# EasyEDA Pro project ProDoc_D133手机主板V0.2_2024-07-06.epro, board PCB1_1
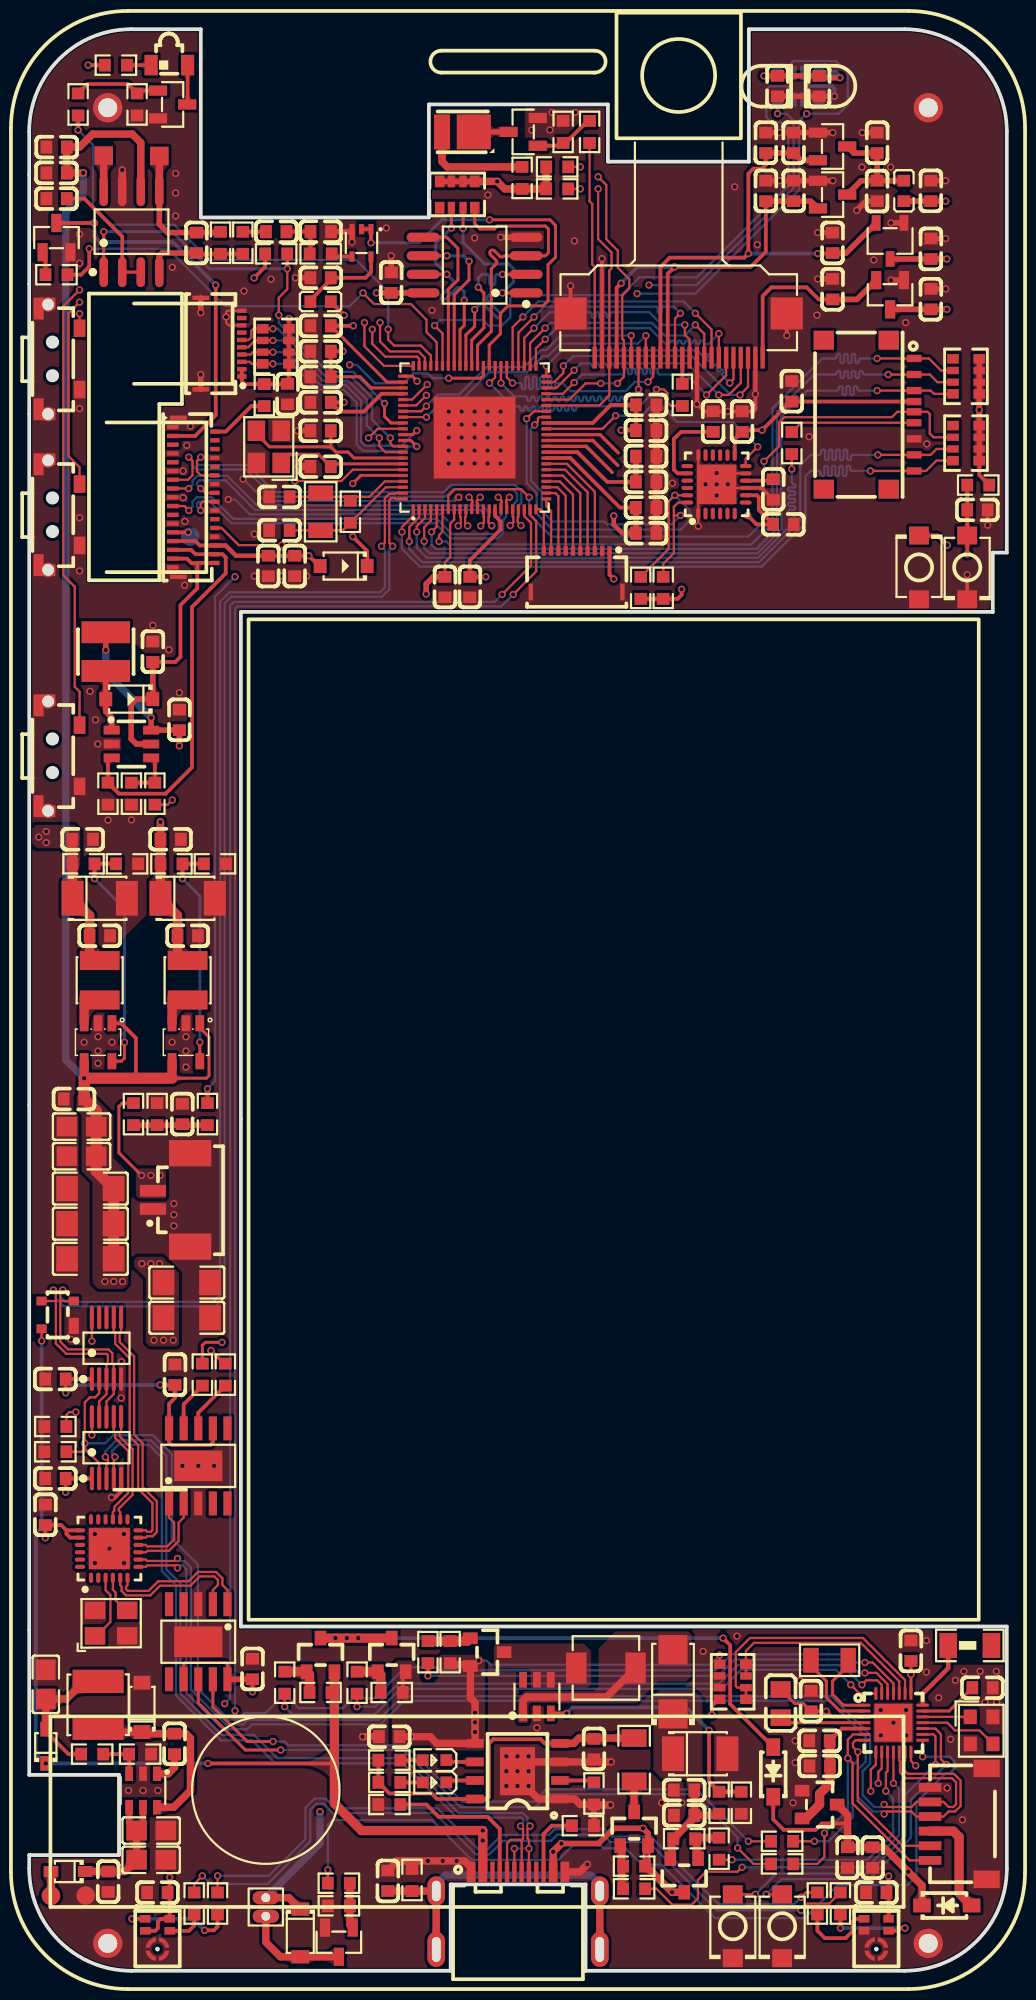
[diagram p5: board, top side]
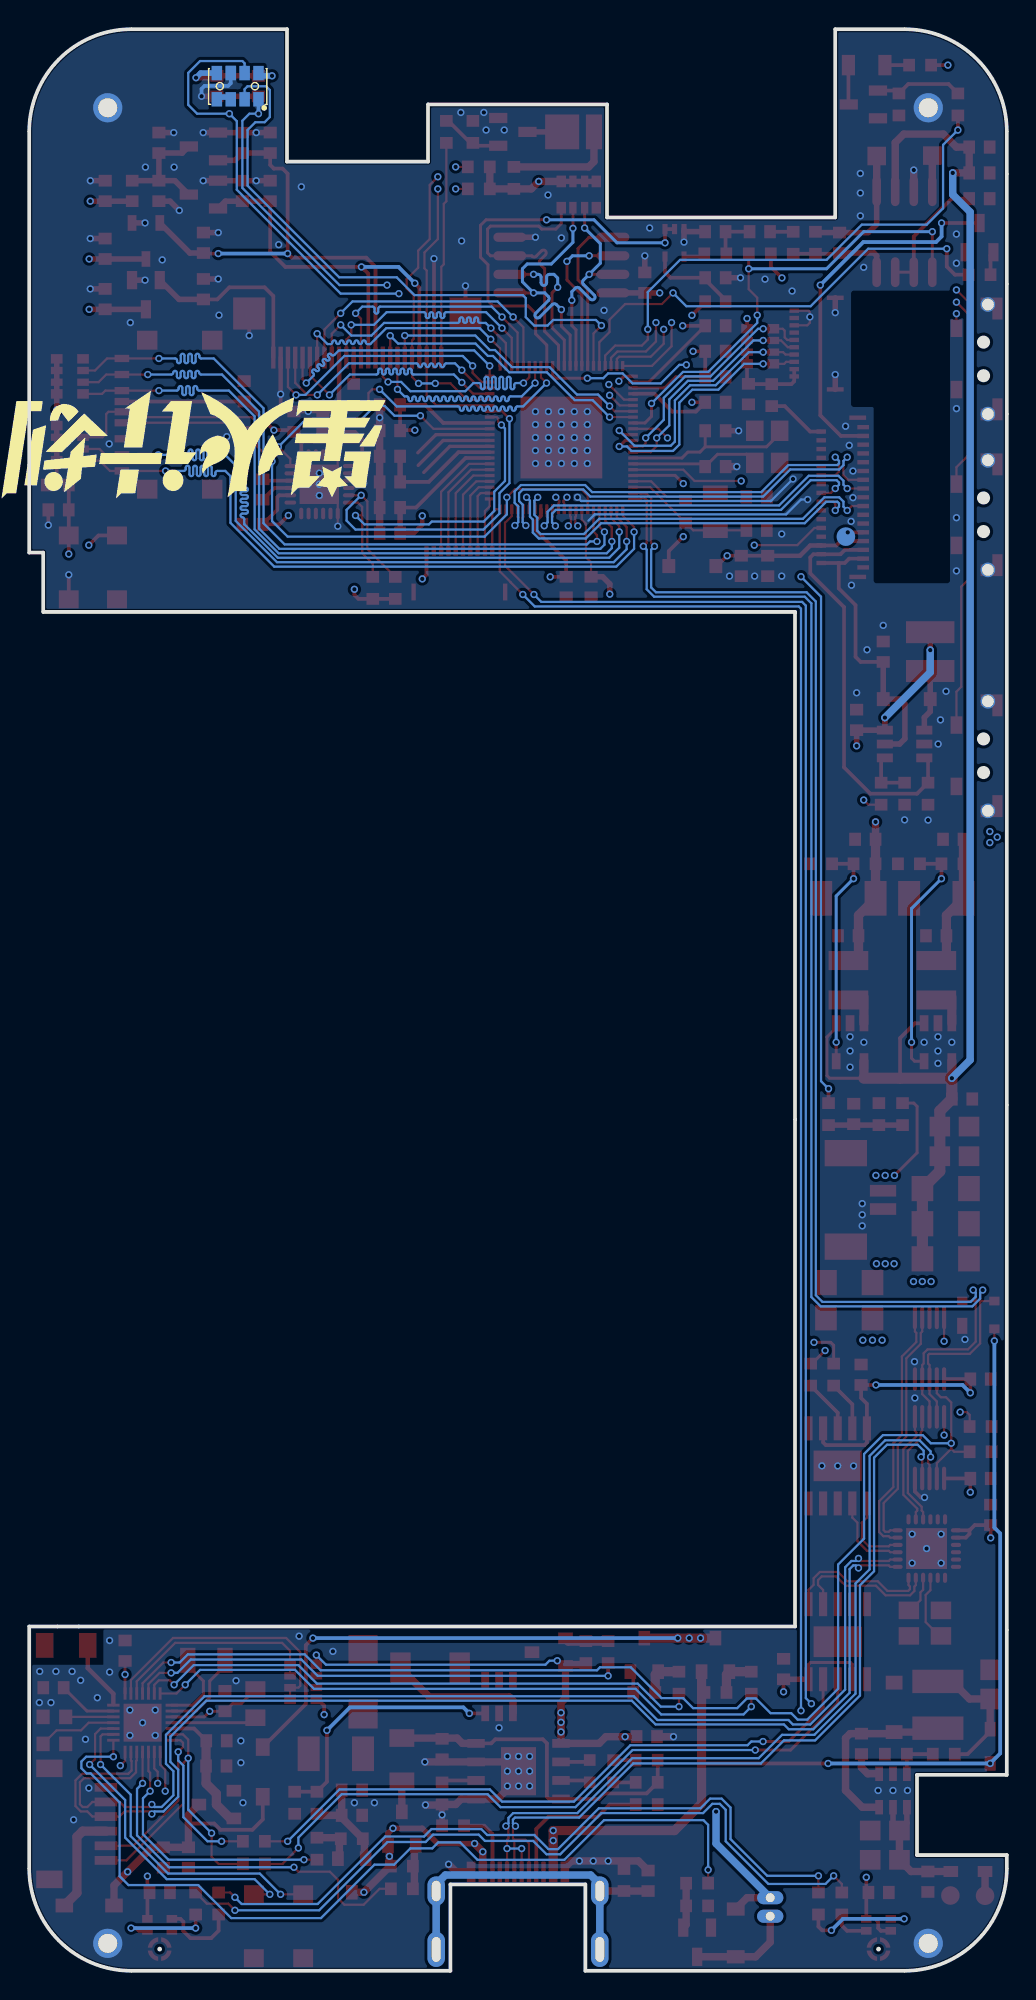
[diagram p6: board, bottom side, seen from below]

Outline 66.94 x 132.94 mm; copper layers: Top Layer, Inner1, Inner2, Bottom Layer. Coordinates in mm from the lower left corner of the outline.
Outline path: 0,125.94 0,13.41 6.15,13.41 6.15,7.92 0,7.92 0,7 arc(2.05,2.05) 7,0 28.86,0 28.86,5.92 38.1,5.92 38.1,0 59.94,0 arc(64.89,2.05) 66.94,7 66.94,23.57 14.5,23.57 14.5,93.04 65.98,93.04 65.98,97.11 66.94,97.11 66.94,125.94 arc(64.89,130.89) 59.94,132.94 49.28,132.94 49.28,123.87 39.63,123.87 39.63,127.79 27.37,127.79 27.37,120.05 11.75,120.05 11.75,132.94 7,132.94 arc(2.05,130.89) 0,125.94
Stack: Top Layer 0.035mm 外层铜厚1oz / Dielectric1 0.2104mm 7628 RC49% 8.6mil / Inner1 0.0152mm 内层铜厚 / Dielectric2 1.065mm 1.1mm H/HOZ Copper / Inner2 0.0152mm 内层铜厚 / Dielectric3 0.2104mm 7628 RC49% 8.6mil / Bottom Layer 0.035mm 外层铜厚1oz

## Design rules (mm)
net VCC_1V1: POWER
net PD27: DP11
net PD26: DP11
net PD1: DCMI
net PD0: DCMI
net USB_DM: DP1
net USB_DP: DP1
net LANE1_P: DP3
net LANE1_N: DP3
net LANE_CLK_P: DP4
net LANE_CLK_N: DP4
net LANE0_P: DP2
net LANE0_N: DP2
net VCC_1V2: POWER
net VBAT: POWER
net A_B10: DP5
net A_B11: DP5
net HUB_DM4: DP10
net HUB_DP4: DP10
net HUB_DM2: DP9
net HUB_DP2: DP9
net HUB_DM1: DP8
net HUB_DP1: DP8
net HUB_IN_DM: DP7
net HUB_IN_DP: DP7
net D133_USB_DM: DP6
net D133_USB_DP: DP6
template: 自定义配置
spacing copperThickness1oz (default): track to track 0.102, other pairs 0.152 to 0.3
spacing copperThickness2oz: track to track 0.203, other pairs 0.152 to 0.3
track width copperThickness1oz (default): min 0.127, default 0.254, max 2.54
track width copperThickness2oz: min 0.203, default 0.254, max 2.54
differential pair differentialPair (default): width min 0.127, default 0.254, max 2.54; gap min 0.152, default 0.152
via viaSize (default): diameter min 0.5, default 0.5, max 10; hole min 0.3, default 0.3, max 6.299

## Placement (name value [footprint] x y rotation side)
C1  22pF  [C0603]  19.95 105.44 180 top
C2  22pF  [C0603]  19.95 102.99 180 top
C3  10uF  [C0603]  10.28 85.65 270 top
C4  10uF  [C0603]  8.46 90.32 270 top
C7  100nF  [C0603]  57.76 7.76 90 top
C8  10uF  [C0603]  56.04 7.76 90 top
C9  100nF  [C0603]  64.93 100.03 0 top
C10  1uF  [C0603]  65.28 19.38 0 top
C11  100nF  [C0603]  53.54 18.47 90 top
C12  1uF  [C0603]  60.38 21.92 90 top
C13  2.2uF  [C0603]  54.12 15.75 180 top
C23  100nF  [C0603]  28.47 94.74 270 top
C24  100nF  [C0603]  42.24 100.19 0 top
C25  10uF  [C0603]  42.24 98.43 0 top
C26  100nF  [C0603]  42.24 103.7 0 top
C27  1uF  [C0603]  42.24 101.94 0 top
C28  100nF  [C0603]  19.95 107.39 180 top
C29  100nF  [C0603]  19.95 109.14 180 top
C30  100nF  [C0603]  19.95 110.89 180 top
C31  10uF  [C0603]  42.24 107.21 0 top
C32  100nF  [C0603]  24.78 115.59 270 top
C33  100nF  [C0603]  52.22 108.15 270 top
C34  12pF  [C0603]  17.13 100.92 180 top
C35  12pF  [C0603]  17.13 98.63 180 top
C36  100nF  [C0603]  42.24 105.46 0 top
C37  100nF  [C0603]  30.17 94.74 270 top
C38  100nF  [C0603]  19.95 112.63 180 top
C39  100nF  [C0603]  17.69 107.96 90 top
C114  10uF  [C0603]  4.83 70.87 0 top
C118  10uF  [C0603]  10.85 70.87 0 top
C121  100nF  [C0603]  61.74 114.46 90 top
C122  100nF  [C0603]  55.01 115.14 90 top
C123  100nF  [C0603]  61.74 117.91 90 top
C124  100nF  [C0603]  55.01 118.31 90 top
C125  100nF  [C0603]  50.44 121.87 270 top
C126  10uF  [C0603]  52.34 121.87 270 top
C127  10uF  [C0603]  58.06 121.87 90 top
C128  10uF  [C0603]  61.74 121.87 270 top
C129  100nF  [C0603]  50.44 125.16 270 top
C130  10uF  [C0603]  52.34 125.16 270 top
C131  10uF  [C0603]  58.06 125.16 270 top
C132  10uF  [C0603]  24.65 16.03 180 top
C133  10uF  [C0603]  38.67 15.18 270 top
C134  10uF  [C0603]  10.48 58.67 90 top
C135  1uF  [C0603]  19.95 115.92 180 top
C136  470nF  [C0603]  19.96 119.08 0 top
C137  100nF  [C0603]  16.91 119.08 180 top
C138  1uF  [C0603]  1.87 121.34 0 top
C139  1nF  [C0603]  11.45 118.31 90 top
C140  10uF  [C0603]  1.87 123.1 0 top
C141  100nF  [C0603]  1.87 124.87 180 top
C142  2.2nF  [C0603]  46.83 106.07 270 top
C143  100nF  [C0603]  50.95 101.42 270 top
C144  100nF  [C0603]  48.81 106.07 270 top
C145  100nF  [C0603]  51.65 99.04 0 top
C146  100nF  [C0603]  51.24 129.05 90 top
C147  100nF  [C0603]  54.09 129.05 90 top
C151  100nF  [C1206]  4.19 48.75 180 top
C152  100nF  [C1206]  4.19 51.15 180 top
C153  100nF  [C1206]  4.19 53.56 180 top
C155  100nF  [C0805]  3.59 55.77 180 top
C156  100nF  [C0805]  3.59 57.8 180 top
C157  100nF  [C0603]  3.06 59.69 180 top
C158  100nF  [C1206]  10.79 44.71 0 top
C159  100nF  [C1206]  10.79 47.12 0 top
C160  100nF  [C0603]  24.56 6.16 90 top
C161  100nF  [C0603]  16.38 96.19 90 top
C162  10uF  [C0603]  18.18 96.19 90 top
C163  100nF  [C0603]  8.78 5.36 180 top
C164  100nF  [C0603]  58 5.36 180 top
C165  220uF  [CASE-B_3528]  4.83 73.43 0 top
C166  220uF  [CASE-B_3528]  10.85 73.43 0 top
C167  100nF  [C0603]  3.67 77.47 0 top
C168  100nF  [C0603]  9.69 77.47 0 top
C169  10uF  [C0603]  44.84 10.64 180 top
C170  220uF  [CASE-B_3528]  45.94 14.86 0 top
C171  100nF  [C0603]  44.84 12.37 180 top
C172  100nF  [C0603]  54.13 14.02 0 top
C173  100nF  [C0603]  1.1 31.22 270 top
C174  100nF  [C0603]  1.8 40.51 0 top
C175  100nF  [C0603]  1.8 33.71 0 top
C176  100nF  [C0603]  9.98 40.81 270 top
C177  100nF  [C0603]  15.29 20.66 270 top
C178  100nF  [C0603]  5.41 6.1 270 top
C179  22uF  [C0805]  8.35 9.6 0 top
C180  22uF  [C0805]  8.35 7.6 0 top
C181  100nF  [C0603]  9.95 15.54 270 top
C182  22uF  [C0805]  1.14 19.61 270 top
CAM1  OV2640  [OV5640]  44.47 120.11 0 top
CN2  1.25-2PWB  [CONN-SMD_2P-P1.25_DEALON_1.25-2PWB]  9.75 52.78 90 top
CN3  A1002WR-S-6P  [CONN-SMD_A1002WR-S-6P]  63.62 10.06 90 top
D1  1N4148W  [SOD-123_L2.7-W1.6-LS3.7-FD]  6.85 87.07 0 top
D2  SR05  [SOT-143_L2.9-W1.3-P1.92-LS2.3-BR]  1.95 44.91 0 top
D3  SS34  [SMA_L4.3-W2.6-LS5.2-RD]  44.08 19.79 90 top
D4  B5819W SL  [SOD-123_L2.7-W1.6-LS3.7-RD-1]  62.83 4.47 0 top
D5  1N5819HW-7-F  [SOD-123_L2.7-W1.6-LS3.7-RD]  18.56 2.59 270 top
D6  B5819W SL  [SOD-123_L2.7-W1.6-LS3.7-RD-1]  50.95 13.62 90 top
D7  1N5819WS  [SOD-323_L1.8-W1.3-LS2.5-RD]  2.66 6.8 180 top
D8  1N5819WS  [SOD-323_L1.8-W1.3-LS2.5-RD]  1.14 15.37 90 top
D9  PMEG6020ELRX  [SOD-123_L2.8-W1.8-LS3.7-RD]  7.72 18.04 90 top
FPC1  0.3K-QX-33PWB  [FPC-SMD_33P-P0.30_HDGC_0.3K-QX-33PWB]  11.27 100.89 270 top
FPC2  HC-FPC-05-10-10RLTAG  [FPC-SMD_10P-P0.50_HCTL_HC-FPC-05-10-10RLTAG]  13.15 111.41 90 top
FPC3  HC-FPC-05-10-10RLTAG  [FPC-SMD_10P-P0.50_HCTL_HC-FPC-05-10-10RLTAG]  37.49 95.81 180 top
IR1  IR26-51C/L110/TR8  [OPTO-SMD_L3.0-W2.6_IR26-51C-L110-TR8]  9.6 130.48 0 top
KEY_DWN  YTS1C0033BBG01  [SW-SMD_YIYUAN_YTS1C003XXX]  2.32 99.67 270 top
KEY_PWR  YTS1C0033BBG01  [SW-SMD_YIYUAN_YTS1C003XXX]  2.32 83.17 270 top
KEY_UP  YTS1C0033BBG01  [SW-SMD_YIYUAN_YTS1C003XXX]  2.32 110.34 270 top
L2  22uH  [IND-SMD_L3.0-W3.0]  5.24 90.32 90 top
L6  2.2uH  [IND-SMD_L3.0-W3.0_FNR30XXS]  4.83 67.82 270 top
L9  BLM18AG601SN1D  [L0603]  19.95 114.28 0 top
L10  2.2uH  [IND-SMD_L3.0-W3.0_FNR30XXS]  10.85 67.82 270 top
L11  4.7uH  [IND-SMD_L4.4-W4.2]  39.49 20.74 180 top
L12  2.2uH  [L0805]  51.46 18.29 270 top
L13  10uH  [IND-SMD_L4.0-W4.0]  4.72 18.21 270 top
LED1  HL-AM-2835H489W-S1-08HL-HR3  [LED-SMD_L3.3-W2.8-RD]  29.36 125.91 180 top
LED2  -  [led_0603]  27.71 12.9 180 top
LED3  -  [led_0603]  27.71 14.42 180 top
MOT1  LCM1027A2445F  [VIBRATING-MOTOR-SMD_WELDING]  16.2 4.37 90 top
NOREF  -  [Pad_e2067]  8.91 124.26 90 top
NOREF#2  -  [Pad_e1874]  11.02 98.2 0 top
NOREF#3  -  [Pad_e1556]  61.56 1.88 180 top
NOREF#4  -  [Pad_e2068]  5.1 124.28 90 top
NOREF#5  -  [Pad_e111]  5.38 127.56 0 top
NOREF#6  -  [Pad_e116]  61.56 127.56 180 top
NOREF#7  -  [Pad_e1554]  5.38 1.88 0 top
Q1  AO3400A  [SOT-23-3_L2.9-W1.3-P1.90-LS2.4-BR]  33.82 125.91 0 top
Q2  2N7002K  [SOT-23-3_L2.9-W1.3-P1.90-LS2.4-BR]  9.82 127.79 180 top
Q3  AO3401A  [SOT-23_L2.9-W1.3-P1.90-LS2.4-BR]  24.82 21.63 270 top
Q5  AO3401A  [SOT-23_L2.9-W1.3-P1.90-LS2.4-BR]  31.36 21.82 180 top
Q6  AO3401A  [SOT-23_L2.9-W1.3-P1.90-LS2.4-BR]  19.95 21.63 270 top
Q7  AO3401A  [SOT-23_L2.9-W1.3-P1.90-LS2.4-BR]  44.85 6.53 90 top
Q8  AO3401A  [SOT-23_L2.9-W1.3-P1.90-LS2.4-BR]  41.42 9.73 270 top
Q9  AO3400A  [SOT-23-3_L2.9-W1.3-P1.90-LS2.4-BR]  21.2 1.96 90 top
Q10  AO3400A  [SOT-23-3_L2.9-W1.3-P1.90-LS2.4-BR]  1.87 118.67 270 top
R2  22R  [R0603]  52.22 104.61 90 top
R3  20R  [R0603]  5.39 80.6 90 top
R4  10K  [R0603]  1.79 35.54 0 top
R5  10K  [R0603]  1.79 37.26 180 top
R6  10K  [R0603]  64.98 101.73 0 top
R7  10MΩ  [R0603]  21.99 99.9 90 top
R8  1K  [R0603]  8.61 80.6 90 top
R9  22R  [R0603]  16.1 107.88 90 top
R10  10K  [R0603]  7 80.6 90 top
R43  510K  [R0603]  3.72 75.8 180 top
R44  110K  [R0603]  6.7 75.8 180 top
R47  68K  [R0603]  9.74 75.8 180 top
R48  82K  [R0603]  12.72 75.8 180 top
R52  20R  [R0603]  33.75 122.76 270 top
R53  1K  [R0603]  38.37 125.91 90 top
R54  20R  [R0603]  44.72 107.9 270 top
R55  10K  [R0603]  36.56 125.91 270 top
R56  400mΩ  [R1206]  41.42 14.45 90 top
R57  1.5kΩ  [R0603]  38.67 12.14 270 top
R58  1K  [R0603]  24.66 12.9 180 top
R59  1K  [R0603]  24.66 14.42 180 top
R60  10K  [R0603]  7.14 58.66 90 top
R61  10K  [R0603]  8.76 58.66 270 top
R62  1K  [R0603]  12.2 58.66 270 top
R63  100R  [R0603]  19.96 117.56 0 top
R64  4.7K  [R0603]  14.62 118.31 90 top
R65  4.7K  [R0603]  16.91 117.56 180 top
R66  51K  [R0603]  13.1 118.31 270 top
R67  4.7K  [R0603]  43.41 94.69 270 top
R68  4.7K  [R0603]  41.87 94.69 270 top
R69  1M  [R0603]  26.21 6.22 90 top
R70  5.1K  [R0603]  37.92 9.93 0 top
R71  5.1K  [R0603]  24.66 11.38 180 top
R72  100R  [R0603]  53.97 4.61 90 top
R73  100R  [R0603]  55.54 4.61 90 top
R74  100R  [R0603]  12.9 4.61 90 top
R75  100R  [R0603]  11.3 4.61 90 top
R76  51R  [R0603]  5.94 130.48 0 top
R77  1K  [R0603]  3.35 127.79 90 top
R78  10K  [R0603]  7.39 127.79 270 top
R79  10K  [R0603]  24.82 19.06 180 top
R80  1K  [R0603]  22.45 19.73 90 top
R81  50K  [R0603]  47.24 11.5 270 top
R82  6.8K  [R0603]  48.76 11.5 90 top
R83  1K  [R0603]  27.3 21.82 90 top
R84  10K  [R0603]  28.82 21.82 90 top
R85  1K  [R0603]  17.5 19.73 90 top
R86  10K  [R0603]  19.95 19.06 180 top
R87  1K  [R0603]  47.24 8.36 90 top
R88  10K  [R0603]  44.85 9.04 0 top
R89  1K  [R0603]  41.42 5.62 180 top
R90  10K  [R0603]  41.42 7.16 180 top
R91  100R  [R0603]  13.43 40.82 90 top
R92  100R  [R0603]  11.86 40.82 90 top
R93  100R  [R0603]  51.56 7.32 0 top
R94  100R  [R0603]  51.56 8.87 0 top
R95  4.7K  [R0603]  36.15 123.51 0 top
R96  4.7K  [R0603]  36.15 122.01 0 top
R97  10K  [R0603]  21.2 4.45 0 top
R98  1K  [R0603]  21.2 6 180 top
R99  1K  [R0603]  1.87 116.13 180 top
R100  82K  [R0603]  4.31 14.84 0 top
R101  16K  [R0603]  7.6 14.84 180 top
RN1  10kΩ  [RES-ARRAY-SMD_0603-8P-L3.2-W1.6-BL]  29.31 121.62 0 top
RN2  47K  [RES-ARRAY-SMD_0603-8P-L3.2-W1.6-BL]  64.16 104.6 90 top
RN3  47K  [RES-ARRAY-SMD_0603-8P-L3.2-W1.6-BL]  64.16 109.17 90 top
RN4  4.7kΩ  [RES-ARRAY-SMD_0603-8P-L3.2-W1.6-BL]  16.89 111.23 270 top
RN5  10kΩ  [RES-ARRAY-SMD_0603-8P-L3.2-W1.6-BL]  48.18 19.79 90 top
SW1  TS-1088R-02026  [SW-SMD_L3.9-W3.0-P4.45]  64.23 96.09 270 top
SW2  TS-1088R-02026  [SW-SMD_L3.9-W3.0-P4.45]  60.93 96.09 90 top
SW3  TS-1088R-02026  [SW-SMD_L3.9-W3.0-P4.45]  51.56 3.05 270 top
SW4  TS-1088R-02026  [SW-SMD_L3.9-W3.0-P4.45]  48.18 3.05 270 top
TP1  -  [Test-Point-0.5mm]  1.49 5.14 180 top
TP2  -  [Test-Point-0.5mm]  3.86 5.15 180 top
U1  D133CBS  [QFN-88_L10.0-W10.0-P0.40-BL-EP]  30.5 104.98 0 top
U2  SY7200AABC  [SOT-23-6_L2.9-W1.6-P0.95-LS2.8-BR]  7 84 180 top
U6  W25Q128JVSIQ  [SOIC-8_L5.3-W5.3-P1.27-LS8.0-BL]  30.5 116.79 90 top
U7  1N5819W  [SOD-123_L2.7-W1.6-LS3.7-FD]  21.53 96.18 0 top
U8  U3  [qfn-28_l4.0-w4.0-p0.40-tl-ep2.6]  59.18 16.99 0 top
U9  XC6206P282MR  [SOT-23-3_L2.9-W1.3-P0.95-LS2.4-BR]  58.95 114.76 90 top
U10  LR8103A-T12  [SOT-23-3_L2.9-W1.6-P1.90-LS2.8-BR]  58.95 118.44 90 top
U11  XC6206P282MR  [SOT-23-3_L2.9-W1.3-P0.95-LS2.4-BR]  55.01 121.62 180 top
U12  BLM18PG121SN1D  [L0603]  59.89 121.87 270 top
U13  XC6206P152MR  [SOT-23-3_L2.9-W1.3-P0.95-LS2.4-BR]  55.01 124.91 180 top
U14  TP4056-42-ESOP8  [ESOP-8_L4.9-W3.9-P1.27-LS6.0-BL-EP]  33.43 13.67 90 top
U15  U74LVC1G08G  [SOT-353-5_L2.0-W1.3-P0.65-LS2.1-BR]  22.75 118.31 90 top
U16  LM4871  [SOIC-8_L4.9-W3.9-P1.27-LS6.0-BL]  7 119.08 0 top
U17  MPU-6050  [QFN-24_L4.0-W4.0-P0.50-BL-EP2.7]  47.06 101.78 0 top
U18  LTR-553ALS-01  [SENSOR-SMD_L3.9-W2.4-P0.95-BL]  52.66 129.04 90 bottom
U22  SD18OB261-060  [MIC-SMD_SD18OB261-060]  8.78 2.29 0 top
U23  SD18OB261-060  [MIC-SMD_SD18OB261-060]  58.01 2.29 0 top
U24  TF-123-ARP9H15  [TF-SMD_TF-123-ARP9H15]  57.5 106.55 90 top
U25  TLV62569DBVR  [SOT-23-5_L3.0-W1.7-P0.95-LS2.8-BR]  4.71 63.58 90 top
U26  MT3608  [SOT-23-6_L2.9-W1.6-P0.95-LS2.8-BL]  34.77 18.77 0 top
U31  TLV62569DBVR  [SOT-23-5_L3.0-W1.7-P0.95-LS2.8-BR]  10.73 63.58 90 top
U32  ANT3216LL00R2400A  [ant-smd_l3.2-w1.6_slk-ssd-3216m-ant2.4g]  64.41 22.28 0 top
U33  XC6206-3.3V  [SSOT-3_L2.9-W1.6-P0.95-LS2.8-BR]  54.12 11.38 180 top
U34  CH334F  [QFN-24_L4.0-W4.0-P0.50-BL-EP2.8]  5.48 28.91 0 top
U35  FSUSB42MUX  [MSOP-10_L3.0-W3.0-P0.50-LS5.0-BL]  5.29 42.62 0 top
U36  FSUSB42MUX  [MSOP-10_L3.0-W3.0-P0.50-LS5.0-BL]  5.29 35.82 0 top
U37  CH340K  [ESOP-10_L4.9-W3.9-P1.00-LS6.0-BL-EP]  11.58 34.57 0 top
U38  CH340K  [ESOP-10_L4.9-W3.9-P1.00-LS6.0-BL-EP]  11.58 22.53 180 top
U39  LGS5145  [SOT-23-6_L2.9-W1.7-P0.95-LS2.8-BL]  7.79 12.35 180 top
USB3  TYPE-C 16P CB0.8 073  [USB-C-SMD_TYPE-C-16P-CB0.8-073]  33.47 4.07 0 top
X1  24MHz  [CRYSTAL-SMD_4P-L3.2-W2.5-BL]  16.4 104.34 90 top
X2  32.768kHz  [OSC-SMD_L3.2-W1.5]  19.96 99.9 90 top
X3  32MHz  [crystal-smd_4p-l2.5-w2.0-bl-a]  65.22 16.46 270 top
X5  32.768kHz  [CRYSTAL-SMD_L3.2-W1.5-1]  54.81 21.26 0 top
X6  12MHz  [OSC-SMD_4P-L3.2-W2.5-BL]  5.61 23.8 0 top

## Footprints (pads in the part's own frame, mm; a bottom-side part is the same pattern mirrored in y, then rotated)
ant-smd_l3.2-w1.6_slk-ssd-3216m-ant2.4g
  rect 1.208x1.701 smd: 1(-1.479,0) 2(1.479,0)
C0603
  rect 0.8x0.9 smd: 1(-0.7,0) 2(0.7,0)
C0805
  rect 1.41x1.35 smd: 1(-1,0) 2(1,0)
C1206
  rect 1.485x1.728 smd: 1(-1.593,0) 2(1.593,0)
CASE-B_3528
  rect 1.506x2.376 smd: 1(-1.861,0) 2(1.861,0)
CONN-SMD_2P-P1.25_DEALON_1.25-2PWB
  rect 0.8x1.8 smd: 1(-0.625,1.275) 2(0.625,1.275)
  rect 1.8x2.9 smd: 3(-3.2,-1.275) 4(3.2,-1.275)
CONN-SMD_A1002WR-S-6P
  rect 0.6x1.55 smd: 1(-2.501,1.938) 2(-1.5,1.938) 3(-0.497,1.936) 4(0.501,1.937) 5(1.502,1.937) 6(2.502,1.937)
  rect 1.2x1.8 smd: 7(3.801,-1.938) 8(-3.801,-1.937)
crystal-smd_4p-l2.5-w2.0-bl-a
  rect 1x0.9 smd: 1(-0.925,-0.775) 2(0.925,-0.775) 3(0.925,0.775) 4(-0.925,0.775)
CRYSTAL-SMD_4P-L3.2-W2.5-BL
  rect 1.4x1.2 smd: 1(-1.1,-0.85) 2(1.1,-0.85) 3(1.1,0.85) 4(-1.1,0.85)
CRYSTAL-SMD_L3.2-W1.5-1
  rect 1.05x1.7 smd: 1(-1.275,0) 2(1.275,0)
ESOP-8_L4.9-W3.9-P1.27-LS6.0-BL-EP
  rect 0.6x1.2 smd: 1(-1.905,-2.909) 2(-0.635,-2.909) 3(0.635,-2.909) 4(1.905,-2.909) 5(1.905,2.909) 6(0.635,2.909) 7(-0.635,2.909) 8(-1.905,2.909)
  rect 3.3x2.4 smd: 9(0,0)
ESOP-10_L4.9-W3.9-P1.00-LS6.0-BL-EP
  rect 0.56x1.64 smd: 1(-2,-2.57) 2(-1,-2.57) 3(0,-2.57) 4(1,-2.57) 5(2,-2.57) 6(2,2.57) 7(1,2.57) 8(0,2.57) 9(-1,2.57) 10(-2,2.57)
  rect 3.3x2.1 smd: 11(0,0)
FPC-SMD_10P-P0.50_HCTL_HC-FPC-05-10-10RLTAG
  rect 0.3x0.65 smd: 1(-2.25,-1.405) 2(-1.75,-1.405) 3(-1.25,-1.405) 4(-0.75,-1.405) 5(-0.25,-1.405) 6(0.25,-1.405) 7(0.75,-1.405) 8(1.25,-1.405) 9(1.75,-1.405) 10(2.25,-1.405)
  rect 0.3x1.15 smd: 11(-3.135,1.405) 12(3.135,1.405)
FPC-SMD_33P-P0.30_HDGC_0.3K-QX-33PWB
  rect 0.3x0.8 smd: 1(-4.8,-1.438) 3(-4.2,-1.438) 5(-3.6,-1.438) 7(-3,-1.438) 9(-2.4,-1.438) 11(-1.8,-1.438) 13(-1.2,-1.438) 15(-0.6,-1.438) 17(0,-1.438) 19(0.6,-1.438) 21(1.2,-1.438) 23(1.8,-1.438) 25(2.4,-1.438) 27(3,-1.438) 29(3.6,-1.438) 31(4.2,-1.438) 33(4.8,-1.438)
  rect 0.3x0.65 smd: 2(-4.5,1.438) 4(-3.9,1.438) 6(-3.3,1.438) 8(-2.7,1.438) 10(-2.1,1.438) 12(-1.5,1.438) 14(-0.9,1.438) 16(-0.3,1.438) 18(0.3,1.438) 20(0.9,1.438) 22(1.5,1.438) 24(2.1,1.438) 26(2.7,1.438) 28(3.3,1.438) 30(3.9,1.438) 32(4.5,1.438)
  rect 0.3x1.15 smd: 34(5.45,-1.062) 35(-5.45,-1.062)
IND-SMD_L3.0-W3.0
  rect 1.5x3.32 smd: 1(1.328,0) 2(-1.328,0)
IND-SMD_L3.0-W3.0_FNR30XXS
  rect 1.3x2.72 smd: 1(1.35,0) 2(-1.35,0)
IND-SMD_L4.0-W4.0
  rect 1.6x3.5 smd: 1(-1.6,0) 2(1.6,0)
IND-SMD_L4.4-W4.2
  rect 1.4x2.12 smd: 1(2.028,0) 2(-2.028,0)
L0603
  rect 0.8x0.864 smd: 1(-0.7,0) 2(0.7,0)
L0805
  rect 1.133x1.377 smd: 1(-0.966,0) 2(0.966,0)
LED-SMD_L3.3-W2.8-RD
  rect 2.33x2.38 smd: 1(-1.087,0)
  rect 1.1x2.38 smd: 2(1.087,0)
led_0603
  rect 0.8x0.8 smd: 1(-0.851,-0.01) 2(0.75,-0.005)
MIC-SMD_SD18OB261-060
  rect 0.725x0.522 smd: 1(-0.838,1.27) 2(-0.838,0.449) 4(0.838,0.449) 5(0.838,1.27)
  custom 0.71x0.71 smd: 3(-0.467,-0.348) 3(-0.455,-1.27) 3(0.455,-0.337) 3(0.467,-1.258)
MSOP-10_L3.0-W3.0-P0.50-LS5.0-BL
  oval 0.28x1.62 smd: 1(-1,-2.11) 2(-0.5,-2.11) 3(0,-2.11) 4(0.5,-2.11) 5(1,-2.11) 6(1,2.11) 7(0.5,2.11) 8(0,2.11) 9(-0.5,2.11) 10(-1,2.11)
OPTO-SMD_L3.0-W2.6_IR26-51C-L110-TR8
  rect 0.9x1.4 smd: 1(-1.25,0) 2(1.25,0)
OSC-SMD_4P-L3.2-W2.5-BL
  rect 1.4x1.2 smd: 1(-1.1,-0.875) 2(1.1,-0.875) 3(1.1,0.875) 4(-1.1,0.875)
OSC-SMD_L3.2-W1.5
  rect 1.05x1.7 smd: 1(-1.275,0) 2(1.275,0)
OV5640
  rect 0.3x1.5 smd: 1(-5.747,-9.659) 2(-5.247,-9.659) 3(-4.747,-9.659) 4(-4.247,-9.659) 5(-3.747,-9.659) 6(-3.247,-9.659) 7(-2.747,-9.659) 8(-2.247,-9.659) 9(-1.747,-9.659) 10(-1.247,-9.659) 11(-0.747,-9.659) 12(-0.247,-9.659) 13(0.253,-9.659) 14(0.753,-9.659) 15(1.253,-9.659) 16(1.753,-9.659) 17(2.253,-9.659) 18(2.753,-9.659) 19(3.253,-9.659) 20(3.753,-9.659) 21(4.253,-9.659) 22(4.753,-9.659) 23(5.253,-9.659) 24(5.753,-9.659)
  rect 2.2x2.2 smd: 25(7.404,-6.636) 26(-7.404,-6.636)
Pad_e111
  round 2 hole 1.3: 1(0,0)
Pad_e116
  round 2 hole 1.3: 1(0,0)
Pad_e1554
  round 2 hole 1.3: 1(0,0)
Pad_e1556
  round 2 hole 1.3: 1(0,0)
Pad_e1874
  round 1.27 smd far side: 1(0,0)
Pad_e2067
  rect 1.27x1.27 smd: 2(0,0)
Pad_e2068
  rect 1.27x1.27 smd: 1(0,0)
QFN-24_L4.0-W4.0-P0.50-BL-EP2.7
  oval 0.28x0.8 smd: 1(-1.25,-2) 2(-0.75,-2) 3(-0.25,-2) 4(0.25,-2) 5(0.75,-2) 6(1.25,-2) 13(1.25,2) 14(0.75,2) 15(0.25,2) 16(-0.25,2) 17(-0.75,2) 18(-1.242,2)
  oval 0.8x0.28 smd: 7(2,-1.25) 8(2,-0.75) 9(2,-0.25) 10(2,0.25) 11(2,0.75) 12(2,1.25) 19(-2,1.25) 20(-2,0.75) 21(-2,0.25) 22(-2,-0.25) 23(-2,-0.75) 24(-2,-1.25)
  rect 2.7x2.7 smd: 25(0.013,0)
QFN-24_L4.0-W4.0-P0.50-BL-EP2.8
  oval 0.28x0.7 smd: 1(-1.25,-2) 2(-0.75,-2) 3(-0.25,-2) 4(0.25,-2) 5(0.75,-2) 6(1.25,-2) 13(1.25,2) 14(0.75,2) 15(0.25,2) 16(-0.25,2) 17(-0.75,2) 18(-1.25,2)
  oval 0.7x0.28 smd: 7(2,-1.25) 8(2,-0.75) 9(2,-0.25) 10(2,0.25) 11(2,0.75) 12(2,1.25) 19(-2,1.25) 20(-2,0.75) 21(-2,0.25) 22(-2,-0.25) 23(-2,-0.75) 24(-2,-1.25)
  rect 2.8x2.8 smd: 25(0.013,0)
qfn-28_l4.0-w4.0-p0.40-tl-ep2.6
  rect 0.85x0.2 smd: 1(-2,1.2) 2(-2,0.8) 3(-2,0.4) 4(-2,0.001) 5(-2,-0.4) 6(-2,-0.8) 7(-2,-1.2) 15(2,-1.2) 16(2,-0.8) 17(2,-0.4) 18(2,0) 19(2,0.4) 20(2,0.8) 21(2,1.2)
  rect 0.2x0.85 smd: 8(-1.2,-2) 9(-0.8,-2) 10(-0.4,-2) 11(0,-2) 12(0.4,-2) 13(0.8,-2) 14(1.2,-2) 22(1.2,2) 23(0.8,2) 24(0.4,2) 25(0,2) 26(-0.4,2) 27(-0.8,2) 28(-1.2,2)
  rect 2.6x2.6 smd: 29(0,-0.001)
QFN-88_L10.0-W10.0-P0.40-BL-EP
  rect 0.224x0.665 smd: 1(-4.2,-4.907) 2(-3.8,-4.907) 3(-3.4,-4.907) 4(-3,-4.907) 5(-2.6,-4.907) 6(-2.2,-4.907) 7(-1.8,-4.907) 8(-1.4,-4.907) 9(-1,-4.907) 10(-0.6,-4.907) 11(-0.2,-4.907) 12(0.2,-4.907) 13(0.6,-4.907) 14(1,-4.907) 15(1.4,-4.907) 16(1.8,-4.907) 17(2.2,-4.907) 18(2.6,-4.907) 19(3,-4.907) 20(3.4,-4.907) 21(3.8,-4.907) 22(4.2,-4.907) 45(4.2,4.907) 46(3.8,4.907) 47(3.4,4.907) 48(3,4.907) 49(2.6,4.907) 50(2.2,4.907) 51(1.8,4.907) 52(1.4,4.907) 53(1,4.907) 54(0.6,4.907) 55(0.2,4.907) 56(-0.2,4.907) 57(-0.6,4.907) 58(-1,4.907) 59(-1.4,4.907) 60(-1.8,4.907) 61(-2.2,4.907) 62(-2.6,4.907) 63(-3,4.907) 64(-3.4,4.907) 65(-3.8,4.907) 66(-4.2,4.907)
  rect 0.665x0.224 smd: 23(4.907,-4.2) 24(4.907,-3.8) 25(4.907,-3.4) 26(4.907,-3) 27(4.907,-2.6) 28(4.907,-2.2) 29(4.907,-1.8) 30(4.907,-1.4) 31(4.907,-1) 32(4.907,-0.6) 33(4.907,-0.2) 34(4.907,0.2) 35(4.907,0.6) 36(4.907,1) 37(4.907,1.4) 38(4.907,1.8) 39(4.907,2.2) 40(4.907,2.6) 41(4.907,3) 42(4.907,3.4) 43(4.907,3.8) 44(4.907,4.2) 67(-4.907,4.2) 68(-4.907,3.8) 69(-4.907,3.4) 70(-4.907,3) 71(-4.907,2.6) 72(-4.907,2.2) 73(-4.907,1.8) 74(-4.907,1.4) 75(-4.907,1) 76(-4.907,0.6) 77(-4.907,0.2) 78(-4.907,-0.2) 79(-4.907,-0.6) 80(-4.907,-1) 81(-4.907,-1.4) 82(-4.907,-1.8) 83(-4.907,-2.2) 84(-4.907,-2.6) 85(-4.907,-3) 86(-4.907,-3.4) 87(-4.907,-3.8) 88(-4.907,-4.2)
  rect 5.6x5.6 smd: 89(0,0)
R0603
  rect 0.806x0.864 smd: 1(-0.753,0) 2(0.753,0)
R1206
  rect 1.208x1.701 smd: 1(-1.479,0) 2(1.479,0)
RES-ARRAY-SMD_0603-8P-L3.2-W1.6-BL
  rect 0.65x0.8 smd: 1(-1.2,-0.9) 4(1.2,-0.9) 5(1.2,0.9) 8(-1.2,0.9)
  rect 0.5x0.8 smd: 2(-0.4,-0.9) 3(0.4,-0.9) 6(0.4,0.9) 7(-0.4,0.9)
SENSOR-SMD_L3.9-W2.4-P0.95-BL
  rect 0.985x0.72 smd: 1(-0.897,-1.425) 2(-0.897,-0.475) 3(-0.897,0.475) 4(-0.897,1.425) 5(0.897,1.425) 6(0.897,0.475) 7(0.897,-0.475) 8(0.897,-1.425)
SMA_L4.3-W2.6-LS5.2-RD
  rect 2x2 smd: 1(-2.2,0) 2(2.2,0)
SOD-123_L2.7-W1.6-LS3.7-FD
  rect 0.88x0.96 smd: 1(-1.61,0) 2(1.61,0)
SOD-123_L2.7-W1.6-LS3.7-RD
  rect 0.91x1.22 smd: 1(-1.635,0) 2(1.635,0)
SOD-123_L2.7-W1.6-LS3.7-RD-1
  rect 1.2x0.95 smd: 1(-1.7,0) 2(1.7,0)
SOD-123_L2.8-W1.8-LS3.7-RD
  rect 0.95x1.15 smd: 1(-1.692,0) 2(1.692,0)
SOD-323_L1.8-W1.3-LS2.5-RD
  rect 1x0.75 smd: 1(-1.173,0) 2(1.173,0)
SOIC-8_L4.9-W3.9-P1.27-LS6.0-BL
  oval 0.588x2.045 smd: 1(-1.905,-2.772) 2(-0.635,-2.772) 3(0.635,-2.772) 4(1.905,-2.772) 5(1.905,2.772) 6(0.635,2.772) 7(-0.635,2.772) 8(-1.905,2.772)
SOIC-8_L5.3-W5.3-P1.27-LS8.0-BL
  oval 0.63x2.25 smd: 1(-1.905,-3.53) 2(-0.635,-3.53) 3(0.635,-3.53) 4(1.905,-3.53) 5(1.905,3.53) 6(0.635,3.53) 7(-0.635,3.53) 8(-1.905,3.53)
SOT-23-3_L2.9-W1.3-P0.95-LS2.4-BR
  rect 1.25x0.7 smd: 1(1,-0.95) 2(1,0.95) 3(-1,0)
SOT-23-3_L2.9-W1.3-P1.90-LS2.4-BR
  rect 1.25x0.7 smd: 1(1,-0.95) 2(1,0.95) 3(-1,0)
SOT-23-3_L2.9-W1.6-P1.90-LS2.8-BR
  rect 1.07x0.6 smd: 1(1.235,-0.95) 2(1.235,0.95) 3(-1.235,0)
SOT-23-5_L3.0-W1.7-P0.95-LS2.8-BR
  rect 1.1x0.6 smd: 1(1.3,-0.95) 2(1.3,0) 3(1.3,0.95) 4(-1.3,0.95) 5(-1.3,-0.95)
SOT-23-6_L2.9-W1.6-P0.95-LS2.8-BL
  rect 0.532x1.072 smd: 1(-0.95,-1.149) 2(0,-1.149) 3(0.95,-1.149) 4(0.95,1.149) 5(0,1.149) 6(-0.95,1.149)
SOT-23-6_L2.9-W1.6-P0.95-LS2.8-BR
  rect 1.1x0.6 smd: 1(1.35,-0.95) 2(1.35,0) 3(1.35,0.95) 4(-1.35,0.95) 5(-1.35,0) 6(-1.35,-0.95)
SOT-23-6_L2.9-W1.7-P0.95-LS2.8-BL
  rect 0.532x0.99 smd: 1(-0.95,-1.145) 2(0,-1.145) 3(0.95,-1.145) 4(0.95,1.145) 5(0,1.145) 6(-0.95,1.145)
SOT-23_L2.9-W1.3-P1.90-LS2.4-BR
  rect 1x0.8 smd: 1(1.15,-0.95) 2(1.15,0.95) 3(-1.15,0)
SOT-143_L2.9-W1.3-P1.92-LS2.3-BR
  rect 0.7x1.1 smd: 1(1.1,-0.75)
  rect 0.7x0.6 smd: 2(1.1,0.95) 3(-1.1,0.95) 4(-1.1,-0.95)
SOT-353-5_L2.0-W1.3-P0.65-LS2.1-BR
  rect 0.7x0.35 smd: 1(0.94,-0.65) 2(0.94,0) 3(0.94,0.65) 4(-0.94,0.65) 5(-0.94,-0.65)
SSOT-3_L2.9-W1.6-P0.95-LS2.8-BR
  rect 1x0.8 smd: 1(1.2,-0.95) 2(1.2,0.95) 3(-1.2,0)
SW-SMD_L3.9-W3.0-P4.45
  rect 1.23x1.36 smd: 1(-2.185,0) 2(2.185,0)
SW-SMD_YIYUAN_YTS1C003XXX
  rect 1.2x0.8 smd: 1(-2.125,1.13) 2(2.075,1.13)
  custom 1.5x1.5 smd: 3(3.425,-1.275) 4(-3.475,-1.275)
  round 1 hole 0.8: 3(3.75,-1.025) 4(-3.75,-1.025)
Test-Point-0.5mm
  round 1.27 smd: 1(0,0)
TF-SMD_TF-123-ARP9H15
  rect 0.5x1 smd: 1(3.85,-3.092) 2(2.75,-3.092) 3(1.65,-3.092) 4(0.9,-3.092) 5(-0.55,-3.092) 6(-1.65,-3.092) 7(-2.75,-3.092) 8(-3.85,-3.092) 9(0.2,-3.092)
  rect 1.3x1.4 smd: 10(-5.1,-1.357) 11(-5.1,3.092) 12(5.1,3.092) 13(5.1,-1.357)
USB-C-SMD_TYPE-C-16P-CB0.8-073
  oval 1.2x2 hole 0.6x1.4: 0(-5.6,1.389) 0(5.6,1.389)
  oval 1.2x2.4 hole 0.6x1.7: 0(-5.6,-2.611) 0(5.6,-2.611)
  rect 0.6x1.4 smd: A1B12(-3.21,2.7) A4B9(-2.41,2.7) B1A12(3.21,2.7) B4A9(2.41,2.7)
  rect 0.3x1.4 smd: A5(-1.25,2.7) A6(-0.25,2.7) A7(0.251,2.7) A8(1.25,2.7) B5(1.75,2.7) B6(0.75,2.7) B7(-0.75,2.7) B8(-1.75,2.7)
VIBRATING-MOTOR-SMD_WELDING
  oval 0.9x1.8 hole 0.61: 1(-0.635,0) 2(0.635,0)

## Nets
As in the schematic, except:
GND: C1.2 C2.2 C3.1 C4.1 C7.1 C8.1 C9.2 C10.2 C11.2 C12.2 C13.2 C23.2 C24.2 C25.2 C26.2 C27.2 C28.2 C29.2 C30.2 C31.2 C32.1 C33.1 C34.2 C35.2 C36.2 C37.2 C38.2 C39.1 C114.2 C118.2 C121.2 C122.2 C123.2 C124.2 C125.1 C126.1 C127.1 C128.1 C129.1 C130.1 C131.1 C132.2 C133.2 C134.2 C135.2 C136.2 C138.1 C140.1 C141.2 C142.1 C143.2 C144.1 C145.2 C146.1 C147.1 C151.2 C152.2 C153.2 C155.2 C156.2 C157.2 C158.2 C159.2 C160.2 C161.1 C162.1 C163.2 C164.2 C165.2 C166.2 C167.2 C168.2 C169.2 C170.2 C171.2 C172.1 C173.1 C174.1 C175.1 C176.1 C177.1 C178.2 C179.2 C180.2 C182.1 CAM1.2 CAM1.15 CAM1.23 CAM1.25 CAM1.26 CN2.1 CN2.3 CN2.4 CN3.6 CN3.7 CN3.8 D2.1 D9.2 FPC1.1 FPC1.7 FPC1.8 FPC1.11 FPC1.14 FPC1.17 FPC1.20 FPC1.23 FPC1.26 FPC1.33 FPC1.34 FPC1.35 FPC2.8 FPC2.10 FPC2.11 FPC2.12 FPC3.2 FPC3.11 FPC3.12 KEY_DWN.2 KEY_DWN.3 KEY_DWN.4 KEY_PWR.2 KEY_PWR.3 KEY_PWR.4 KEY_UP.2 KEY_UP.3 KEY_UP.4 NOREF#3.1 NOREF#5.1 NOREF#6.1 NOREF#7.1 Q1.2 Q2.2 Q9.2 Q10.2 R3.1 R4.1 R5.2 R10.1 R44.1 R48.1 R55.1 R57.2 R61.1 R69.2 R70.2 R71.2 R78.2 R82.1 R97.1 R101.1 RN5.6 RN5.7 SW1.2 SW2.1 SW3.2 SW4.2 TP2.1 U1.89 U2.2 U6.4 U8.29 U9.1 U10.1 U11.1 U13.1 U14.1 U14.3 U14.9 U15.3 U16.7 U17.1 U17.9 U17.11 U17.18 U17.25 U18.6 U22.3 U23.2 U23.3 U24.6 U25.2 U26.2 U31.2 U33.1 U34.25 U35.5 U36.5 U37.3 U37.11 U38.3 U38.11 U39.2 USB3.A1B12 USB3.B1A12 X1.2 X1.4 X3.2 X3.4 X6.2 X6.4
PWM_OUT: FPC1.25 NOREF#2.1
SPK_+: C139.2 NOREF.2 R66.1 U16.5
SPK_-: NOREF#4.1 U16.8

Pads without a net: FPC1 6 9 10 21 22; FPC2 7; RN1 1; RN2 5; RN3 5; U17 2 3 4 5 6 7 14 15 16 17 19 21 22; U24 10 11 12 13; U26 6; U32 2; U34 1 2 13 16 17 18 21 22 23 24; U37 4 5 6; U38 4 5 6; USB3 A8 B8

## Via types
v1: diameter 0.5, hole 0.3, Top Layer to Bottom Layer, 409 vias
v2: diameter 0.5, hole 0.299, Top Layer to Bottom Layer, 50 vias

## Routing (per net, layer and track width the routed paths; a pad name or vN(x,y) marks a point on that pad's centre or on a via; arc(x,y) is an arc through that point)
GND: length 143.4
  Top Layer w0.152: 45.82,103.78 45.82,103.03 v1(47.07,101.78) ; U17.9 47.32,101.53 v1(47.07,101.78) ; FPC2.10 13.58,113.66 13.48,113.56 v1(13.48,113.24) 13.48,112.84 13.66,112.66 FPC2.8 ; v1(47.07,101.78) 45.81,100.52 U17.1 v1(45.81,98.91) ; v1(47.07,101.78) 47.82,102.53 U17.11
  Top Layer w0.254: U36.5 6.29,32.82 5.89,32.41 v1(5.63,32.41) ; U17.9 50.14,101.53 C143.2 ; C9.2 v1(65.63,98.99) ; CAM1.25 v1(51.87,111.97) ; v1(49.72,107.95) 49.72,106.93 49.56,106.77 C144.1 v1(47.84,106.77) C142.1 46.22,106.77 v1(45.72,107.27) ; CAM1.2 v1(39.22,117.23) ; CAM1.26 v1(37.07,115.37) ; SW1.2 v1(64.23,95.59)
  Top Layer w0.305: CAM1.15 v1(45.72,107.27) ; CAM1.23 v1(49.72,107.95)
  Top Layer w0.381: C127.1 57.3,121.17 v1(56.66,120.53) ; C146.1 C147.1 v1(55.14,128.35) ; C131.1 v1(57.04,125.86) ; v1(55.03,122.57) U11.1 C126.1 v1(51.39,122.57) C125.1 ; U6.4 v1(32.28,118.7) ; FPC2.12 v1(11.75,113.53) ; U9.1 v1(59.01,115.76) ; C32.1 v1(24.78,117.43) ; C129.1 v1(51.39,125.86) C130.1 U13.1 v1(55.03,125.86) ; C122.2 v1(54,115.84) ; R57.2 v1(38.67,10.68) R70.2 ; U10.1 v1(59.01,119.68) ; C124.2 v1(54,119.02) ; C128.1 v1(62.75,122.57) ; C136.2 22.1,119.08 ; U15.3 v1(22.1,118.37) ; C121.2 v1(62.76,115.16) ; 19.25,105.44 v1(18.36,105.44) ; FPC2.11 v1(11.75,109.3) ; C123.2 v1(62.76,118.61) ; 19.25,115.92 v1(18.24,115.92)
  Top Layer w0.508: R57.2 37.73,11.39 37.36,11.76 U14.1 34.87,11.76 33.43,13.2 v1(33.43,13.67) 34.07,14.3 U14.3 v1(39.85,14.3) ; v1(39.8,11.36) 39.8,11.35 38.67,11.35 ; C160.2 25.22,7.52 v1(27.3,7.52) v1(28.32,7.52) v1(29.27,7.52) 29.81,7.52 30.26,7.07 USB3.A1B12 ; v1(38.22,7.29) 37.7,6.77 USB3.B1A12 ; C31.2 v1(42.94,106.34) C36.2 C26.2 C27.2 C24.2 C25.2 ; v1(18.49,102.99) 19.25,102.99 ; U16.7 v1(6.37,123.3) ; C132.2 v1(22.82,16.03)
  Bottom Layer w0.152: v1(13.63,100.74) 14.09,100.74 15.11,99.72 28.21,99.72 28.65,99.29 ; v1(29.4,100.89) 29.15,100.64 16.15,100.64 14.64,102.15
  Bottom Layer w0.254: v1(55.14,128.35) 55.14,128.86 54.94,129.06 53.32,129.06 53.14,129.24 U18.6
  vias: v1(2.86,43.23) v1(3.45,99.49) v1(3.45,95.85) v1(3.77,63.58) v1(4.16,87.61) v1(4.5,29.9) v1(4.5,27.92) v1(4.54,85.65) v1(4.7,84) v1(4.71,63.95) v1(4.71,62.98) v1(4.71,62.13) v1(5.39,78.79) v1(5.49,28.91) v1(5.66,63.58) v1(6.29,39.22) v1(6.32,41.71) v1(6.49,29.9) v1(6.49,27.92) v1(7,78.8) v1(8.46,92.12) v1(9.57,90.45) v1(9.8,116.64) v1(9.79,63.58) v1(9.9,52.53) v1(9.9,51.77) v1(9.9,51) v1(10.03,123.06) v1(10.03,121.72) v1(10.03,120.16) v1(10.28,87.5) v1(10.49,34.57) v1(10.54,102.69) v1(10.54,100.87) v1(10.66,99.24) v1(10.64,94.87) v1(10.79,104.45) v1(10.73,63.95) v1(10.73,62.98) v1(10.73,61.87) v1(11.58,34.57) v1(12.66,34.57) v1(14.64,102.14) v1(14.7,115.01) v1(15.41,98.38) v1(15.41,95.49) v1(16.56,115.83) v1(17.27,95.49) v1(18.99,95.49) v1(24.46,119.33) v1(27.58,113.69) v1(28.72,106.76) v1(28.72,105.87) v1(28.72,104.98) v1(28.72,104.09) v1(28.72,103.2) v1(29.61,106.76) v1(29.61,105.87) v1(29.61,104.98) v1(29.61,104.09) v1(29.61,103.2) v1(30.5,118.65) v1(30.5,106.76) v1(30.5,105.87) v1(30.5,104.98) v1(30.5,104.09) v1(30.5,103.2) v1(31.39,106.76) v1(31.39,105.87) v1(31.39,104.98) v1(31.39,104.09) v1(31.39,103.2) v1(31.41,121.59) v1(32.28,106.76) v1(32.28,105.87) v1(32.28,104.98) v1(32.28,104.09) v1(32.28,103.2) v1(32.67,14.68) v1(32.67,13.67) v1(32.67,12.65) v1(33.43,14.68) v1(33.43,12.65) v1(34.2,14.68) v1(34.2,13.67) v1(34.2,12.65) v1(34.41,126.04) v1(34.77,16.64) v1(35.65,126.04) v1(35.81,127.24) v1(37.38,127.24) v1(37.33,118.44) v1(43.3,11.51) v1(44.04,101.86) v1(44.67,11.51) v1(46.31,101.78) v1(47.07,102.54) v1(47.07,101.02) v1(47.84,101.78) v1(48.31,122.15) v1(49.85,118.19) v1(52.3,11.51) v1(52.45,14.25) v1(53.41,105.04) v1(53.94,113.36) v1(57.02,123.5) v1(57.83,117.15) v1(58.31,17.85) v1(58.31,16.12) v1(58.98,123.5) v1(59.18,16.99) v1(60.01,112.85) v1(60.04,17.85) v1(60.04,16.12) v1(61.46,104.55) v1(61.43,22.62) v1(61.43,20.45) v1(62.28,18.7) v1(62.85,12.51) v1(63.09,15.85) v1(63.42,19.89) v1(63.9,10.34) v1(64,20.5) v1(65.11,20.5) v1(65.45,18.37) v1(66.22,20.5) v1(66.25,18.37) v2(3.45,118.91) v2(3.45,116.92) v2(3.45,106.96) v2(6.8,12.35) v2(7.79,12.35) v2(8.81,12.35) v2(11.04,105.76) v2(46.15,21.87) v2(48.46,22.91) v2(52.45,15.75) v2(52.78,19.86)
VBAT: length 58.8
  Top Layer w0.152: RN5.5 v2(47.28,21.62)
  Top Layer w0.203: v1(7.69,54.46) 6.14,56.01 6.14,59.18 6.37,59.41 R60.2
  Top Layer w0.254: Q5.2 30.42,20.87 v2(30.78,21.23) ; R79.1 25.58,20.28 Q3.2
  Top Layer w0.508: C132.1 v2(26.14,16.03) 27.45,16.03 27.91,15.57 U14.5 v1(30.53,16.35) v1(30.53,17.01) v1(30.53,17.67) 30.53,18.37 30.21,18.68 Q5.2 ; D5.1 17.78,5.01 MOT1.2 ; 30.07,20.96 28.87,20.96
  Inner2 w0.508: v2(19.91,10.9) 19.91,14.56 20.62,15.27 25.37,15.27 v2(26.14,16.03)
  Bottom Layer w0.152: v2(47.28,21.62) 46.62,20.96 31.59,20.96 31.32,21.23 v2(30.78,21.23)
  Bottom Layer w0.508: MOT1.2 19.91,8.71 v2(19.91,10.9)
  vias: v1(7.72,48.41) v1(8.33,54.46) v1(8.32,48.41) v1(8.54,43.18) v1(8.96,54.46) v1(8.93,48.41) v1(9.2,43.18) v1(9.86,43.18)
VCC_1V1: length 111.6
  Top Layer w0.152: C23.1 28.47,96.44 28.82,96.8 28.82,99.09 29.1,99.36 U1.8
  Top Layer w0.203: U1.68 24.5,108.78 C38.1
  Top Layer w0.254: C24.1 40.45,100.19 37.06,103.58 U1.30 ; C38.1 v1(22.19,112.63)
  Top Layer w0.305: v1(40.03,99.62) 40.03,99.01 40.61,98.43 C25.1
  Top Layer w0.381: C23.1 27.67,95.44 27.18,94.96 v1(27.18,94.26) ; C24.1 C25.1
  Top Layer w0.508: C168.1 v1(8.99,78.67)
  Top Layer w0.635: L10.2 10.15,69.17 C118.1 10.15,72.27 C166.1 R47.2 C168.1
  Inner2 w0.381: v1(22.19,112.63) 23.16,111.67 23.16,106 21.38,104.22 21.38,99.01 20.65,98.27 16.96,98.27 16.63,97.94 16.63,94.72 ; 16.63,94.72 16.15,94.24 13.89,94.24 13.3,93.65 13.3,80.47 12.31,79.48 9.8,79.48 v1(8.99,78.67) ; 16.63,94.72 17.09,94.26 v1(27.18,94.26) 31.39,94.26 32.02,94.9 33.53,94.9 34.16,94.26 36.49,94.26 37.51,95.28 37.51,99.09 38.45,100.03 39.62,100.03 v1(40.03,99.62)
VCC_1V2: length 33.7
  Top Layer w0.254: v1(54,117.58) 54.97,117.58 C124.1 ; CAM1.10 43.22,116.66 43.86,117.3 48.97,117.3 v1(49.25,117.58) 49.25,123.05 49.59,123.39 50.19,123.39 50.44,123.65 50.44,124.46
  Top Layer w0.381: U13.2 52.84,123.96 52.34,124.46 50.44,124.46 ; U10.2 55.94,117.61 C124.1
  Bottom Layer w0.254: v1(49.25,117.58) v1(54,117.58)
VCC_3V3: length 169.2
  Top Layer w0.203: U1.69 23.42,108.38 22.66,109.14 C29.1 ; U38.7 10.58,20.97 10.71,21.11 13.43,21.11 13.58,20.96 U38.10
  Top Layer w0.254: U7.1 19.85,96.18 v1(19.15,96.89) C162.2 C161.2 ; v1(1.1,29.64) C173.2 2.19,30.52 2.55,30.16 ; U35.1 C174.2 v1(2.5,39.57) ; v1(9.62,6.4) U22.5 9.01,3.56 8.81,3.35 8.81,2.92 8.62,2.74 U22.2 ; v2(40.03,95.3) 39.74,95.59 FPC3.1 ; 5.19,130.48 v1(4.03,130.48) ; U36.1 C175.2 v1(2.5,32.77) ; R65.2 16.16,116.67 v1(15.4,115.91) ; v1(40.53,105.49) 41.51,105.49 C36.1 C31.1 39.82,107.21 38.59,105.98 U1.36 ; U17.13 48.31,104.87 48.93,105.49 v1(50.19,105.49) 52.14,107.45 U24.4 ; RN2.1 65.06,102.41 R6.2 ; U23.5 v1(58.85,6.48) ; v1(17.79,113.13) RN4.8 RN4.7 RN4.6 RN4.5 17.79,108.75 C39.2 17.67,108.64 R9.2 14.75,108.64 14.56,108.83 FPC2.1 FPC2.2 ; C29.1 C30.1 v1(21.48,110.89) ; FPC1.28 11.68,97.59 11.38,97.89 FPC1.27 ; U17.8 49.82,101.03 49.96,100.89 49.96,100.03 C145.1 49.8,99.04 v2(49.19,99.65) ; 2.55,30.16 2.55,29.91 2.81,29.66 U34.20 ; 2.55,30.16 U34.19 ; U1.15 31.9,99.62 32.28,99.24 32.28,98.68 30.17,96.58 C37.1 v1(31.26,95.44) ; v1(8.96,40.11) C176.2 9.98,39.22 9.58,38.82 U37.10 9.58,36.16 9.75,35.99 12.39,35.99 12.58,36.18 U37.7 ; C177.2 v2(15.29,19.1) ; v2(44.67,94.59) 44.67,94.21 44.4,93.94 41.87,93.94
  Top Layer w0.305: FPC1.28 13.45,97.59 14.16,96.89 C161.2
  Top Layer w0.381: RN3.4 RN3.3 RN3.2 RN3.1 v1(65.06,106.87) RN2.2 RN2.1 ; v1(62.83,117.21) C123.1 U10.3 ; v1(62.76,121.17) C128.2 U12.2 ; RN1.6 RN1.7 RN1.8 ; RN1.6 30.51,122.52 ; RN1.6 29.71,122.49 ; U6.8 C32.2 v1(23.77,114.89) ; U38.10 C177.2 ; U9.3 C121.1 v1(62.83,113.76) ; v1(55.52,129.62) 54.22,129.62 C147.2 C146.2 v1(50.31,129.75)
  Top Layer w0.508: 30.51,122.52 v1(32.05,122.52) 32.56,122.01 R52.2 R96.1 R95.1
  Top Layer w0.635: C167.1 R43.2 C165.1 4.13,72.27 C114.1 4.13,69.17 L6.2
  Inner2 w0.254: v1(2.5,39.57) v1(2.5,32.77)
  Bottom Layer w0.254: v1(8.96,40.11) 3.03,40.11 v1(2.5,39.57)
  Bottom Layer w0.381: v1(50.31,129.75) 51.05,129.75 U18.8 ; U18.5 55.2,129.94 v1(55.52,129.62)
  vias: v1(0.66,77.62) v1(1.16,78) v1(1.16,77.25)
VCC_AF: length 13.1
  Top Layer w0.254: C122.1 54.06,114.44 53.23,115.27 50.82,115.27 50.22,114.67 CAM1.24
  Top Layer w0.381: C122.1 56.68,114.44 U9.2
VCC_CH: length 9
  Top Layer w0.254: C13.1 55.65,16.59 U8.5
  Top Layer w0.635: U33.2 53.17,10.43 54.12,11.38 54.12,12.12 54.83,12.83 C172.2 54.83,15.73 C13.1
VCC_CHG: length 2.1
  Top Layer w0.508: R56.1 Q8.3
VCC_USB: length 97.9
  Top Layer w0.152: D2.4 v1(0.85,43.13)
  Top Layer w0.254: RN5.8 47.18,18.59 46.74,18.15 v2(46.74,17.54) ; 20.9,14.2 v2(12.24,14.2)
  Top Layer w0.381: v1(36.44,8.71) 38.98,8.71 40.03,9.76 v1(42.03,9.76) 42.37,9.41 Q8.2
  Top Layer w0.508: USB3.B4A9 v1(35.88,8.15) v1(36.44,8.71) ; 42.28,8.38 v1(42.28,7.84) 42.28,7.12 v1(44.02,5.38) Q7.3
  Top Layer w0.635: USB3.A4B9 v1(31.06,8.92) v1(31.06,9.6) 22.75,9.6 20.9,11.46 Q6.2
  Inner2 w0.254: v1(42.03,9.76) 42.03,12.83 v2(46.74,17.54)
  Bottom Layer w0.254: v1(0.85,43.13) 0.85,30.35 0.45,29.95 0.45,14.88 v2(1.14,14.2) v2(12.24,14.2)
VCC_WILE: length 9.4
  Top Layer w0.254: D8.2 1.14,16.38 2.69,14.84 R100.1
  Top Layer w0.508: L13.1 3.75,19.81 2.55,18.61 C182.2 D8.2
VCCSYS: length 183.7
  Top Layer w0.203: U31.1 11.68,64.56 12.31,63.93 12.31,61.29 12.14,61.11 9.78,61.11
  Top Layer w0.254: 7.31,61.11 7.31,63.86 6.29,64.88 U25.1 ; D6.2 48,18.26 48,22.29 v2(47.51,22.78)
  Top Layer w0.381: v1(5.24,90.43) L2.1 ; v1(10.28,83.87) C3.2 U2.6 v1(8.35,85.8)
  Top Layer w0.508: U16.6 7.64,125.17 7.06,125.76 4.34,125.76 3.45,124.87 C141.1 C140.2 v1(3.7,123.1)
  Top Layer w0.635: U31.4 9.78,61.11 ; U25.4 v1(3.76,61.11) ; Q6.3 v1(20.97,22.78) v1(22.53,22.78) Q3.3
  Top Layer w0.762: 9.78,61.11 v1(3.76,61.11) C157.1 4.59,58.87 C156.1 C155.1 4.59,54.75 C153.1 C152.1 C151.1
  Inner2 w0.381: v1(10.28,83.87) 8.33,81.92 8.33,79.05 8.32,79.05 8.32,64.31 5.13,61.11 v1(3.76,61.11)
  Bottom Layer w0.254: v2(47.51,22.78) v1(22.53,22.78)
  Bottom Layer w0.508: v1(3.76,61.11) 2.51,62.37 2.51,120.42 3.7,121.62 v1(3.7,123.1) ; v1(8.35,85.8) 5.24,88.91 v1(5.24,90.43)
  vias: v1(5.18,47.19) v1(5.79,47.19) v1(6.39,47.19) v1(21.75,22.78)
A_A4: length 18
  Top Layer w0.152: RN5.1 RN5.2 48.5,19.39 48.38,19.51 48.38,21.82 49.35,22.79 57.09,22.79 59.98,19.9 U8.23
A_A5: length 14.4
  Top Layer w0.152: U8.24 59.58,19.82 56.94,22.46 49.63,22.46 49.08,21.91 RN5.4 RN5.3
A_A8: length 22.5
  Top Layer w0.152: CN3.1 60.28,7.56 56.38,11.46 56.38,14.23 v1(56.05,14.56) 56.05,15.83 56.41,16.19 U8.6 ; R93.2 53.97,7.32 54.45,7.8 v2(54.45,9.43)
  Bottom Layer w0.152: v1(56.05,14.56) 56.05,11.03 v2(54.45,9.43)
A_A9: length 20.5
  Top Layer w0.152: CN3.2 59.81,8.56 56.74,11.63 v1(56.74,14.99) 56.41,15.32 56.41,15.61 56.59,15.79 U8.7 ; R94.2 v2(53.77,8.87)
  Bottom Layer w0.152: v2(53.77,8.87) 54.73,8.87 56.38,10.52 56.38,14.05 56.74,14.4 v1(56.74,14.99)
A_A10: length 6
  Top Layer w0.203: U8.2 55.51,17.79 54.58,18.72 54.58,19.84 53.53,20.89 X5.1
A_A11: length 5.3
  Top Layer w0.203: X5.2 56.08,20.91 55.01,19.84 55.01,18.93 55.75,18.19 U8.1
A_A12: length 43.5
  Top Layer w0.152: v1(56.26,19.59) 56.85,18.99 U8.28 ; R85.1 v1(17.5,18.09)
  Bottom Layer w0.152: v1(17.5,18.09) 18.03,17.55 23.67,17.55 25.42,19.31 47.44,19.31 48.74,20.6 55.24,20.6 v1(56.26,19.59)
A_A13: length 39.4
  Top Layer w0.152: v1(57.02,19.59) 57.32,19.89 58.06,19.89 58.38,19.57 U8.27 ; v1(22.45,18.09) R80.1
  Bottom Layer w0.152: v1(22.45,18.09) 23.69,18.09 25.27,19.66 47.24,19.66 48.51,20.93 55.67,20.93 v1(57.02,19.59)
A_A14: length 34.2
  Top Layer w0.152: U8.26 58.78,19.63 58.01,20.4 v1(57.22,20.4)
  Top Layer w0.254: R83.1 v1(27.3,20.19)
  Bottom Layer w0.152: v1(57.22,20.4) 56.79,20.4 55.87,21.31 48.31,21.31 47.19,20.19 v1(27.3,20.19)
A_A15: length 85.3
  Top Layer w0.152: 3.8,35.74 v1(3.8,36.12) 3.8,38.91 4.16,39.27 4.52,39.27 4.79,39.55 U35.2 ; 3.8,35.74 3.6,35.54 R4.2 ; 3.8,35.74 4.79,34.75 U36.2 ; v1(57.22,21.11) 57.75,21.11 59.18,19.69 U8.25
  Bottom Layer w0.152: v1(57.22,21.11) 56.64,21.11 56.08,21.67 48.08,21.67 46.98,20.58 28.06,20.58 27.86,20.78 25.75,20.78 23.64,18.67 22.17,18.67 21.48,17.98 18.46,17.98 17.8,18.65 17.18,18.65 16.17,17.64 14.76,17.64 14.32,17.2 13.66,17.2 11.55,19.31 11.55,27.81 9.77,29.59 9.77,35.38 8.48,36.68 5.76,36.68 5.2,36.12 v1(3.8,36.12)
A_B4: length 61.9
  Top Layer w0.152: R98.2 v2(20.45,6.91) ; U8.15 61.18,14.66
  Bottom Layer w0.152: v1(61.18,14.66) 63.04,14.66 63.37,14.33 63.37,13.87 63.01,13.51 62.73,13.51 60.75,11.53 60.75,6.48 60.14,5.87 55.37,5.87 53.11,3.61 46.96,3.61 43.3,7.27 41.96,7.27 40.84,8.38 39.34,8.38 38.93,8.79 37.43,8.79 36.24,7.6 30.3,7.6 27.58,10.31 20.77,10.31 20.45,9.99 v2(20.45,6.91)
A_B7: length 1.1
  Top Layer w0.152: U8.14 60.38,14.37 v1(60.7,14.05)
A_B10: length 81
  Top Layer w0.152: U8.13 59.98,14.41 59.93,14.36 59.93,13.72 60.16,13.49 63.32,13.49 63.77,13.03 63.77,11.28 63.4,10.91 62.96,10.91 62.61,10.56 CN3.4 60.76,10.56 60.41,10.91 58.72,10.91 v1(58.54,10.74) ; U34.7 7.98,27.66 8.08,27.76 9.98,27.76 v2(10.15,27.58)
  Bottom Layer w0.152: v1(58.54,10.74) 58.37,10.91 57.74,10.91 56.74,11.91 56.74,13.77 57.27,14.3 57.27,16.03 54.81,18.49 25.67,18.49 24.05,16.87 15.26,16.87 14.93,16.54 13.25,16.54 10.76,19.03 10.76,27.5 10.51,27.76 10.33,27.76 v2(10.15,27.58)
A_B11: length 80.4
  Top Layer w0.152: U8.12 59.58,14.41 59.62,14.36 59.62,13.59 60.03,13.19 63.19,13.19 63.47,12.91 63.47,11.41 63.28,11.21 62.96,11.21 62.61,11.56 CN3.5 60.76,11.56 60.41,11.21 58.72,11.21 v1(58.54,11.39) ; U34.8 7.98,28.16 8.08,28.06 9.98,28.06 v2(10.15,28.23)
  Bottom Layer w0.152: v2(10.15,28.23) 10.33,28.06 10.64,28.06 11.07,27.63 11.07,19.25 13.46,16.87 14.65,16.87 14.95,17.17 23.92,17.17 25.55,18.8 54.93,18.8 57.58,16.16 57.58,14.18 57.07,13.67 57.07,12.02 57.87,11.21 58.37,11.21 v1(58.54,11.39)
A_B12: length 26.4
  Top Layer w0.152: v2(48.81,7.09) 48.51,6.78 46.35,6.78 45.79,6.22 45.79,4.95 45.36,4.52 44.04,4.52 42.95,5.62 R89.1 ; U8.11 v1(59.18,12.84)
  Bottom Layer w0.152: v1(59.18,12.84) 59.56,12.45 59.56,9.27 57.37,7.09 v2(48.81,7.09)
A_B13: length 18.5
  Top Layer w0.152: U8.10 58.78,13.67 58.66,13.56 v1(58.66,12.3) ; R87.1 v1(48.13,7.6)
  Bottom Layer w0.152: v1(58.66,12.3) 59.15,11.81 59.15,9.35 57.41,7.6 v1(48.13,7.6)
A_B14: length 2.2
  Top Layer w0.152: U8.9 58.38,13.86 58.14,13.62 v1(58.14,12.84)
A_B15: length 2.8
  Top Layer w0.152: v1(57.63,12.3) 57.63,13.77 57.98,14.12 U8.8
A_B22: length 22.3
  Top Layer w0.152: v1(62.8,14.12) 62.43,14.5 62.43,16.21 62.05,16.59 U8.17 ; 51.56,5.23 v1(50.46,5.23)
  Bottom Layer w0.152: v1(62.8,14.12) 60.37,11.69 60.37,9.12 57.53,6.28 51.51,6.28 v1(50.46,5.23)
A_B23: length 22.1
  Top Layer w0.152: v1(62.06,14.12) 62.06,16.05 61.92,16.19 U8.16 ; 48.18,5.23 v1(49.73,5.23)
  Bottom Layer w0.152: v1(62.06,14.12) 59.99,12.06 59.99,9.22 57.42,6.66 51.15,6.66 v1(49.73,5.23)
ADC_BAT: length 36.8
  Top Layer w0.254: R62.1 v1(12.2,60.4)
  Bottom Layer w0.152: v1(14.09,95.45) 12.72,94.08 12.72,60.91 v1(12.2,60.4)
BUZZER: length 19.7
  Top Layer w0.152: R54.2 43.95,107.15 43.71,107.39 43.71,108.03 43.45,108.28 v1(42.95,108.28) ; U1.52 31.9,109.1 v1(31.52,108.71)
  Bottom Layer w0.152: v1(42.95,108.28) 41.78,107.11 37.57,107.11 arc(37.48,107.08) 37.45,106.99 37.45,106.94 arc(37.32,106.81) 37.19,106.94 37.19,106.99 arc(37.07,107.11) 36.94,106.99 36.94,106.94 arc(36.81,106.81) 36.69,106.94 36.69,106.99 arc(36.56,107.11) 36.43,106.99 36.43,106.94 arc(36.3,106.81) 36.18,106.94 36.18,106.99 arc(36.05,107.11) 35.92,106.99 35.92,106.94 arc(35.8,106.81) 35.67,106.94 35.67,106.99 arc(35.54,107.11) 35.42,106.99 35.42,106.94 arc(35.29,106.81) 35.16,106.94 35.16,106.99 arc(35.03,107.11) 34.91,106.99 34.91,106.94 arc(34.78,106.81) 34.65,106.94 34.65,106.99 arc(34.53,107.11) 34.4,106.99 34.4,106.94 arc(34.27,106.81) 34.15,106.94 34.15,106.99 arc(34.02,107.11) 33.89,106.99 33.89,106.94 arc(33.76,106.81) 33.64,106.94 33.64,106.99 arc(33.6,107.08) 33.51,107.11 33.12,107.11 v1(31.52,108.71)
CAN0_RX: length 20.4
  Top Layer w0.152: v1(23.24,104.95) 23.86,105.58 U1.76 ; v1(17.29,97.61) 14.35,97.61 13.17,98.79 FPC1.24
  Inner2 w0.152: v1(17.29,97.61) 22.35,97.61 22.7,97.97 22.7,104.42 v1(23.24,104.95)
CAN0_TX: length 33.2
  Top Layer w0.152: v1(17.67,116.54) 17.67,115.14 17.09,114.56 v1(17.09,113.36)
  Top Layer w0.203: U16.1 v1(5.1,119.08) ; v1(17.67,116.54) 17.67,117.55 ; v1(24.33,107.32) 24.33,106.43 24.78,105.98 U1.75
  Bottom Layer w0.152: v1(24.33,107.32) 22.17,109.48 20.44,109.48 17.09,112.83 v1(17.09,113.36)
  Bottom Layer w0.203: v1(17.67,116.54) 12.34,116.54 9.8,119.08 v1(5.1,119.08)
CTP_LED: length 32.3
  Top Layer w0.152: U1.62 27.9,111.51 27.2,112.2 27.2,113.05 26.13,114.12 23.62,114.12 v2(22.85,114.89)
  Top Layer w0.254: R99.1 3.55,116.13 4.11,116.69 v2(4.11,117.91)
  Bottom Layer w0.152: v2(22.85,114.89) 21.94,113.97 13.43,113.97 9.49,117.91 v2(4.11,117.91)
CTP_LEDA: length 4.1
  Top Layer w0.254: R9.1 15.2,107.13 13.46,105.39 FPC1.2
CTP_LEDK: length 25.6
  Top Layer w0.254: v2(12.77,115.42) 12.77,106.5 11.36,105.09 FPC1.3 ; Q10.3 v2(4.47,119.67)
  Bottom Layer w0.254: v2(4.47,119.67) 4.47,118.75 4.85,118.37 9.82,118.37 v2(12.77,115.42)
D133_USB_DM: length 91.7
  Top Layer w0.152: U1.87 25.11,101.18 25.06,101.13 24.66,101.13 24.35,100.83 24.35,97.77 v1(24.12,97.54) ; 2.13,45.86 2.13,46.44 v1(2.3,46.61) ; 2.13,45.86 3.05,45.86 ; 2.13,45.86 2.13,43.08 2.66,42.55 5.43,42.55 5.69,42.28 5.69,41.58 5.79,41.48 U35.4 5.79,39.49 5.29,38.99 U36.8
  Bottom Layer w0.152: v1(24.12,97.54) 24.35,97.31 24.35,94.72 24.02,94.39 13.71,94.39 13.08,93.75 13.08,46.25 12.62,45.8 2.48,45.8 2.13,46.15 2.13,46.44 v1(2.3,46.61)
D133_USB_DP: length 92.3
  Top Layer w0.152: 1.82,45.86 1.82,46.44 v1(1.65,46.61) ; 1.82,45.86 1.82,42.95 2.53,42.24 5.3,42.24 5.39,42.16 5.39,41.58 5.29,41.48 U35.3 5.29,39.49 4.79,38.99 U36.9 ; 1.82,45.86 0.85,45.86 ; v1(24.89,97.54) 24.66,97.77 24.66,100.7 24.78,100.83 25.06,100.83 25.11,100.78 U1.88
  Bottom Layer w0.152: v1(1.65,46.61) 1.82,46.44 1.82,46.03 2.36,45.49 12.74,45.49 13.38,46.13 13.38,93.63 13.84,94.08 24.15,94.08 24.66,94.59 24.66,97.31 v1(24.89,97.54)
DVP_CK: length 19.7
  Top Layer w0.152: v1(33.8,113.23) 33.1,112.53 U1.49 ; CAM1.17 46.72,112.38 v1(45.61,113.49)
  Bottom Layer w0.152: v1(45.61,113.49) 44.8,114.3 34.87,114.3 v1(33.8,113.23)
DVP_D0: length 18.2
  Top Layer w0.152: CAM1.19 47.72,109.24 v1(46.38,107.9) ; U1.41 36.54,107.98 v1(37.32,108.75)
  Bottom Layer w0.152: v1(46.38,107.9) 44.98,109.3 43.17,109.3 arc(43.08,109.34) 43.04,109.42 43.04,109.58 arc(42.91,109.7) 42.79,109.58 42.79,109.42 arc(42.66,109.3) 42.53,109.42 42.53,109.58 arc(42.4,109.7) 42.28,109.58 42.28,109.42 arc(42.15,109.3) 42.02,109.42 42.02,109.58 arc(41.9,109.7) 41.77,109.58 41.77,109.42 arc(41.64,109.3) 41.52,109.42 41.52,109.58 arc(41.39,109.7) 41.26,109.58 41.26,109.42 arc(41.13,109.3) 41.01,109.42 41.01,109.58 arc(40.88,109.7) 40.75,109.58 40.75,109.42 arc(40.72,109.34) 40.63,109.3 37.86,109.3 v1(37.32,108.75)
DVP_D1: length 18.1
  Top Layer w0.152: v1(37.32,109.59) 36.1,108.38 U1.42 ; v1(47.21,107.9) 47.9,107.9 48.72,108.72 CAM1.21
  Bottom Layer w0.152: v1(37.32,109.59) 37.78,110.06 38.39,110.06 arc(38.48,110.02) 38.52,109.93 arc(38.64,109.81) 38.77,109.93 arc(38.9,110.06) 39.03,109.93 arc(39.15,109.81) 39.28,109.93 arc(39.41,110.06) 39.53,109.93 arc(39.66,109.81) 39.79,109.93 arc(39.91,110.06) 40.04,109.93 arc(40.17,109.81) 40.29,109.93 arc(40.33,110.02) 40.42,110.06 45.05,110.06 v1(47.21,107.9)
DVP_D2: length 18.2
  Top Layer w0.152: v1(36.57,109.89) 36.57,109.4 35.95,108.78 U1.43 ; CAM1.22 49.22,108.46 v1(48.67,107.9)
  Bottom Layer w0.152: v1(48.67,107.9) 48.03,107.9 45.36,110.57 37.26,110.57 v1(36.57,109.89)
DVP_D3: length 18.2
  Top Layer w0.152: v1(47.97,108.71) 48.22,108.97 CAM1.20 ; U1.44 v1(35.41,109.89)
  Bottom Layer w0.152: v1(47.97,108.71) 47.48,109.2 arc(47.45,109.29) 47.48,109.38 47.53,109.43 arc(47.54,109.61) 47.36,109.61 47.3,109.56 arc(47.12,109.56) 47.12,109.74 47.18,109.79 arc(47.18,109.97) 47,109.97 46.94,109.92 arc(46.76,109.92) 46.76,110.1 46.82,110.15 arc(46.82,110.33) 46.64,110.33 46.59,110.28 arc(46.41,110.28) 46.41,110.46 46.46,110.51 arc(46.46,110.69) 46.28,110.69 46.23,110.64 arc(46.14,110.6) 46.05,110.64 45.73,110.95 36.47,110.95 v1(35.41,109.89)
DVP_D4: length 18.1
  Top Layer w0.152: v1(47.22,112.09) CAM1.18 ; U1.45 34.7,111.09 35.33,111.71 v1(35.34,111.71)
  Bottom Layer w0.152: v1(35.34,111.71) 36.1,112.47 42.49,112.47 43.58,111.38 43.77,111.38 arc(43.86,111.42) 43.89,111.51 arc(44.02,111.63) 44.15,111.51 arc(44.27,111.38) 44.4,111.51 arc(44.53,111.63) 44.66,111.51 arc(44.78,111.38) 44.91,111.51 arc(45.04,111.63) 45.16,111.51 arc(45.29,111.38) 45.42,111.51 arc(45.54,111.63) 45.67,111.51 arc(45.8,111.38) 45.93,111.51 arc(46.05,111.63) 46.18,111.51 arc(46.22,111.42) 46.31,111.38 46.51,111.38 v1(47.22,112.09)
DVP_D5: length 18.2
  Top Layer w0.152: U1.46 34.3,111.45 v1(35.33,112.47) ; CAM1.16 46.22,112.09 v1(45.61,112.7)
  Bottom Layer w0.152: v1(45.61,112.7) 44.88,111.97 43.5,111.97 42.64,112.83 37.6,112.83 arc(37.51,112.87) 37.47,112.96 37.47,113.08 arc(37.35,113.21) 37.22,113.08 37.22,112.96 arc(37.09,112.83) 36.97,112.96 36.97,113.08 arc(36.84,113.21) 36.71,113.08 36.71,112.96 arc(36.58,112.83) 36.46,112.96 36.46,113.08 arc(36.33,113.21) 36.2,113.08 36.2,112.96 arc(36.17,112.87) 36.08,112.83 35.68,112.83 v1(35.33,112.47)
DVP_D6: length 18.2
  Top Layer w0.152: CAM1.14 45.22,111.69 44.89,112.02 v1(44.89,112.7) ; U1.47 33.9,111.81 v1(34.56,112.47)
  Bottom Layer w0.152: v1(44.89,112.7) 43.33,112.7 42.46,113.56 39.91,113.56 arc(39.82,113.53) 39.79,113.44 39.79,113.29 arc(39.66,113.16) 39.53,113.29 39.53,113.44 arc(39.41,113.56) 39.28,113.44 39.28,113.29 arc(39.15,113.16) 39.03,113.29 39.03,113.44 arc(38.9,113.56) 38.77,113.44 38.77,113.29 arc(38.64,113.16) 38.52,113.29 38.52,113.44 arc(38.48,113.53) 38.39,113.56 35.66,113.56 v1(34.56,112.47)
DVP_D7: length 18.2
  Top Layer w0.152: v1(44.59,113.49) 44.22,113.12 CAM1.12 ; U1.48 33.5,112.17 v1(34.56,113.23)
  Bottom Layer w0.152: v1(44.59,113.49) 44.13,113.95 43.42,113.95 arc(43.33,113.91) 43.29,113.82 43.29,113.59 arc(43.17,113.46) 43.04,113.59 43.04,113.82 arc(43,113.91) 42.91,113.95 35.28,113.95 v1(34.56,113.23)
DVP_HS: length 19.6
  Top Layer w0.152: v1(42.37,108.79) 42.72,109.15 CAM1.9 ; v1(33.09,108.71) 32.7,109.1 U1.50
  Bottom Layer w0.152: v1(42.37,108.79) 41.47,108.79 40.84,108.16 37.08,108.16 36.52,108.71 36.14,108.71 arc(36.05,108.68) 36.01,108.59 36.01,108.41 arc(35.89,108.28) 35.76,108.41 35.76,109.02 arc(35.63,109.15) 35.5,109.02 35.5,108.41 arc(35.38,108.28) 35.25,108.41 35.25,109.02 arc(35.12,109.15) 35,109.02 35,108.41 arc(34.87,108.28) 34.74,108.41 34.74,109.02 arc(34.62,109.15) 34.49,109.02 34.49,108.41 arc(34.36,108.28) 34.24,108.41 34.24,109.02 arc(34.11,109.15) 33.98,109.02 33.98,108.41 arc(33.85,108.28) 33.73,108.41 33.73,108.59 arc(33.69,108.68) 33.6,108.71 v1(33.09,108.71)
DVP_VS: length 19.5
  Top Layer w0.152: CAM1.7 v1(41.72,108.28) ; U1.51 v1(32.3,108.71)
  Bottom Layer w0.152: v1(41.72,108.28) 41.24,107.8 41.09,107.8 arc(41,107.76) 40.96,107.67 40.96,107.6 arc(40.84,107.47) 40.71,107.6 40.71,107.67 arc(40.58,107.8) 40.46,107.67 40.46,107.6 arc(40.33,107.47) 40.2,107.6 40.2,107.67 arc(40.08,107.8) 39.95,107.67 39.95,107.6 arc(39.82,107.47) 39.69,107.6 39.69,107.67 arc(39.57,107.8) 39.44,107.67 39.44,107.6 arc(39.31,107.47) 39.19,107.6 39.19,107.67 arc(39.06,107.8) 38.93,107.67 38.93,107.6 arc(38.81,107.47) 38.68,107.6 38.68,107.67 arc(38.55,107.8) 38.42,107.67 38.42,107.6 arc(38.3,107.47) 38.17,107.6 38.17,107.67 arc(38.04,107.8) 37.92,107.67 37.92,107.6 arc(37.79,107.47) 37.66,107.6 37.66,107.67 arc(37.54,107.8) 37.41,107.67 37.41,107.6 arc(37.28,107.47) 37.15,107.6 37.15,107.67 arc(37.03,107.8) 36.9,107.67 36.9,107.6 arc(36.77,107.47) 36.65,107.6 36.65,107.67 arc(36.52,107.8) 36.39,107.67 36.39,107.6 arc(36.27,107.47) 36.14,107.6 36.14,107.67 arc(36.01,107.8) 35.88,107.67 35.88,107.6 arc(35.76,107.47) 35.63,107.6 35.63,107.67 arc(35.5,107.8) 35.38,107.67 35.38,107.6 arc(35.25,107.47) 35.12,107.6 35.12,107.67 arc(35,107.8) 34.87,107.67 34.87,107.6 arc(34.74,107.47) 34.61,107.6 34.61,107.67 arc(34.49,107.8) 34.36,107.67 34.36,107.6 arc(34.23,107.47) 34.11,107.6 34.11,107.67 arc(34.07,107.76) 33.98,107.8 33.21,107.8 v1(32.3,108.71)
